# EAGLE design Redhat-Thumbprint (EAGLE 7.7.0)
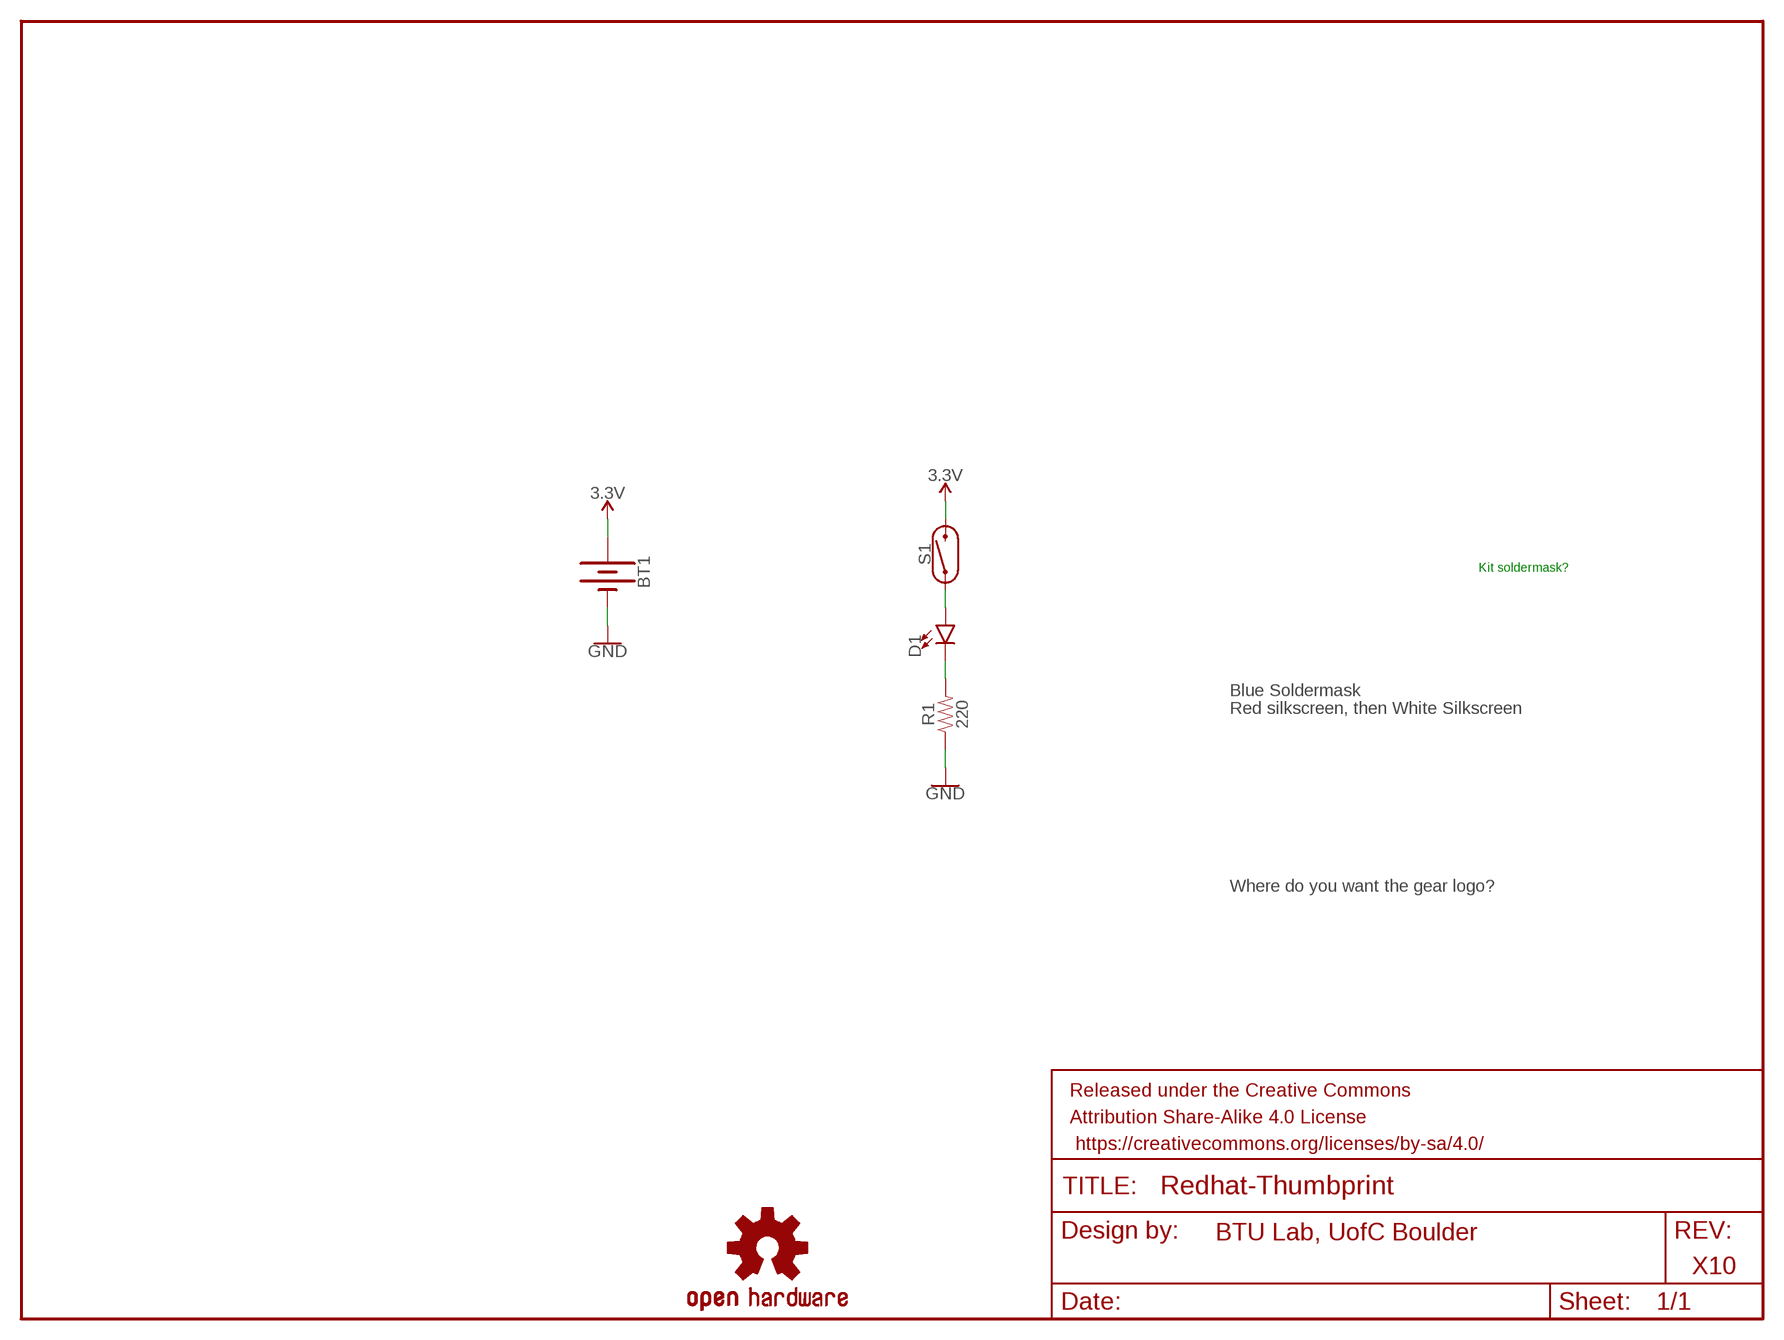
[diagram p0: schematic, sheet 1]

## Parts
BT1  BATTERY-20MM_PTH  [BATTCOM_20MM_PTH]
D1  LEDRED  [LED_5MM_EXTRASILK]
FRAME1  FRAME-LETTER  [CREATIVE_COMMONS]
LOGO4  OSHW-LOGOS  [OSHW-LOGO-S]
R1  220  1KOHM-HORIZ-1/4W-1%  [AXIAL-0.3]
S1  REED_SWITCH-PTH-INSULATED  [REED_SWITCH_PLASTIC]

## Nets
3.3V: BT1.1(+) S1.P$2
GND: BT1.2(-) R1.P$1
N$3: D1.K(C) R1.P$2
N$4: D1.A S1.P$1

## Notes on the sheet
- Kit soldermask?
- Blue Soldermask
- Red silkscreen, then White Silkscreen
- Where do you want the gear logo?
- BTU Lab, UofC Boulder
- X10

## Library data of the parts
BT1 = SparkFun-Batteries:BATTERY: Battery - Single Cell A variety of battery chemistries, sizes, and footprints. Device List: 20MM_PTH - Coin Cell Battery Holder - 20mm (PTH) <https://www.sparkfun.com/products/783> 12MM_SMD - Coin Cell Battery Holder - 12mm (SMD) <https://www.sparkfun.com/products/10592> 12MM_PTH - Coin Cell Battery Holder - 12mm (PTH) <https://www.sparkfun.com/products/7948> 20MM_SMD - 20mm Coin Cell Battery Holder (SMD) (2 legs) Used on the Big Time Watch Kit <https://www.sparkfun.com/products/11734> 20MM_SMD_4LEGS - Coin Cell Battery Holder - 20mm (SMD) <https://www.sparkfun.com/products/11892> 20MM_SMD_4LEGS_OVERPASTE - Coin Cell Battery Holder - 20mm (SMD) <https://www.sparkfun.com/products/11892> (Over-paste on the legs) 24.5MM_PTH - Coin Cell Battery Holder - 24.5mm (PTH) <https://www.sparkfun.com/products/8863> 9V - 9V Battery Holder - PC Mount Used on the SparkFun SparkPunk Sound Kit <https://www.sparkfun.com/products/11177> and SparkFun SparkPunk Sequencer Kit <https://www.sparkfun.com/products/12707> 18650 - Battery Holder - 18650 (PTH) <https://www.sparkfun.com/products/13113> AA - Battery Holder - 1xAA (PTH) <https://www.sparkfun.com/products/7949> AAA - Battery Holder - 1xAAA (PTH) <https://www.sparkfun.com/products/12718> AA_KIT - Battery Holder - 1xAA (PTH) <https://www.sparkfun.com/products/7949> Special kit package - pads only have exposed copper on one side of the board. AAA_KIT - Battery Holder - 1xAAA (PTH) <https://www.sparkfun.com/products/12718> Special kit package - pads only have exposed copper on one side of the board.; PROD_ID: BATT-09031; SF_SKU: PRT-00783
D1 = SparkX:LED
FRAME1 = SparkFun-Aesthetics:FRAME-LETTER: Schematic Frame - Letter Standard 8.5x11 US Letter frame
LOGO4 = SparkFun-Aesthetics:OSHW-LOGO: Open-Source Hardware (OSHW) Logo This logo indicates the piece of hardware it is found on incorporates a OSHW license and/or adheres to the definition of open source hardware found here: http://freedomdefined.org/OSHW
R1 = SparkFun-Resistors:1KOHM: 1kΩ resistor A resistor is a passive two-terminal electrical component that implements electrical resistance as a circuit element. Resistors act to reduce current flow, and, at the same time, act to lower voltage levels within circuits. - Wikipedia; PROD_ID: RES-12182; VALUE: 1k
S1 = SparkFun-Switches:REED_SWITCH: Reed Switch A reed switch is a magnetically-actuated switch. When the device is exposed to a magnetic field, the two ferrous materials inside the switch pull together and the switch closes. Variant Overview PTH-GLASS Reed Switch <https://www.sparkfun.com/products/8642> (COM-08642) - PTH reed switch w/ glass body (6.0 x 0.9 mm) PTH-INSULATED Reed Switch - Insulated <https://www.sparkfun.com/products/10601> (COM-10601) - PTH reed switch w/ insulated body (15.1 x 4.2 mm); PROD_ID: SWCH-10467; SF_SKU: COM-10601

## Board
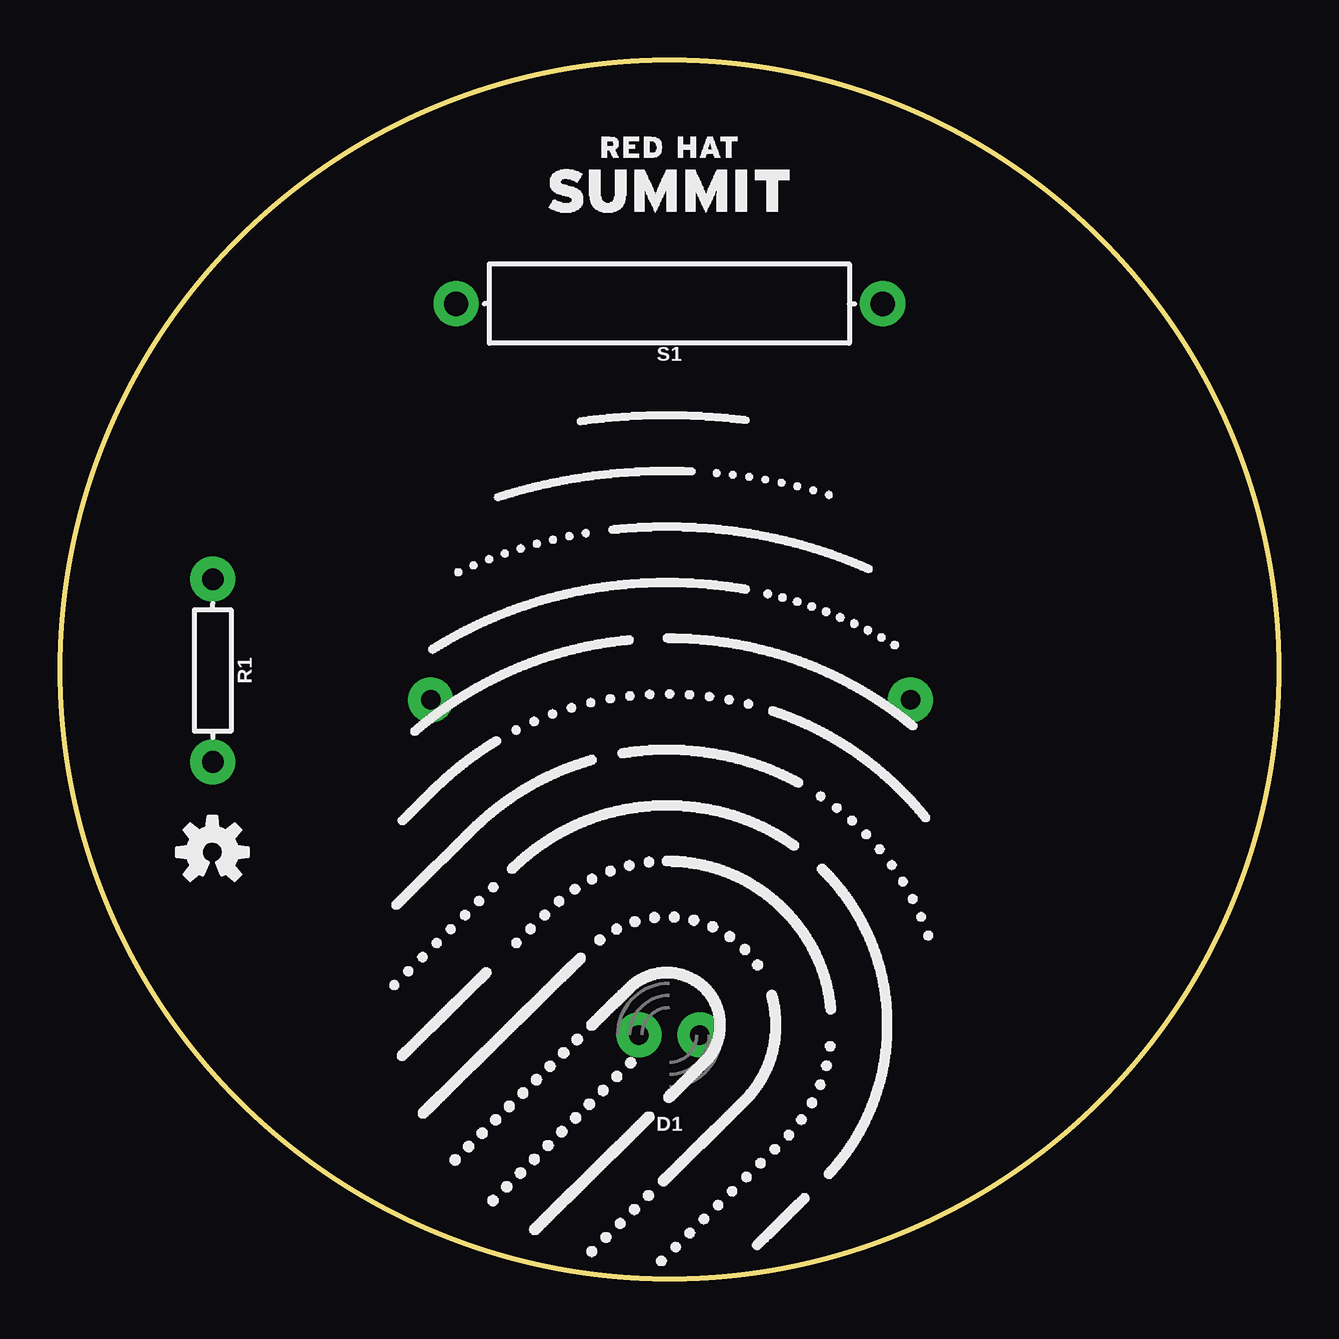
[diagram p1: board, top side]
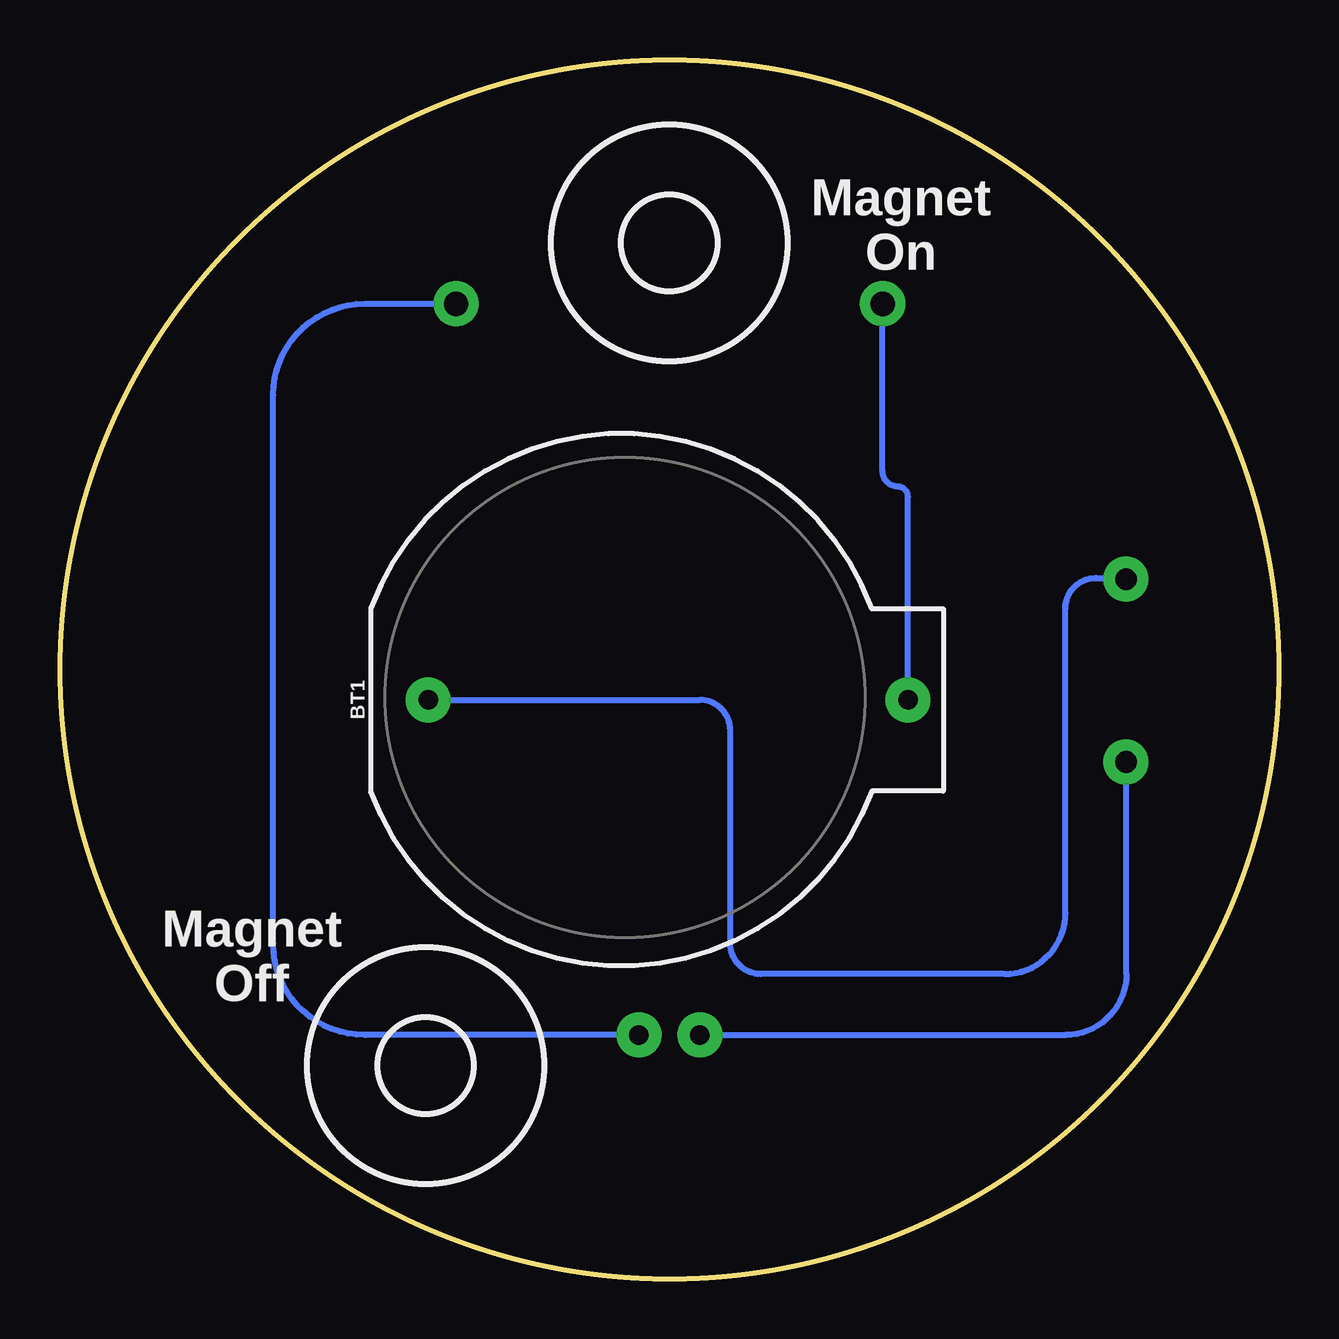
[diagram p2: board, bottom side, seen from below]

Size 50.8 x 50.8 mm. Coordinates in mm from the lower left corner, seen from the top.
Outline: circle at 25.4,25.4 radius 25.4
Copper layers (1*16): Top 0.035mm / dielectric 1.5mm / Bottom 0.035mm
Design rules "SparkFun-2-layer-TIGHT": minimum track width 7mil, minimum drill 15mil, track to track 7mil, track to pad 7mil, pad to pad 7mil, via to via 7mil, smd to smd 7mil, copper to edge 7mil, drill to drill 7mil, minimum pad ring 7mil, minimum via ring 7mil, stop-mask expansion 4mil, vias tented up to drill 25mil, thermal gap 10mil

### Footprints (pad centres in the part's own frame; a part is rotated, then mirrored left to right if it is on the bottom)
BATTCOM_20MM_PTH = drill 0.813 pad 1.88: 1 11.85,0; 2 -8.15,0
LED_5MM_EXTRASILK = drill 0.813 pad 1.88: A -1.27,0; K 1.27,0
AXIAL-0.3 = drill 0.9 pad 1.88: P$1 -3.81,0; P$2 3.81,0
REED_SWITCH_PLASTIC = drill 1.016 pad 1.88: P$1 -8.89,0; P$2 8.89,0

### Placement (x,y rotation side)
BT1  27.3,24.13 0 bottom
D1  25.4,10.16 180 top
FRAME1  -19.05,-25.4 0 top  (outside the outline)
LOGO4  6.35,17.78 0 top
R1  6.37,25.35 270 top
S1  25.4,40.64 180 top

### Tracks (layer width: path | path; a pad name or v marks a point on that pad's centre or on a via)
3.3V
  Bottom 0.254: BT1.1 15.45,32.6 arc-90 15.87,33.02 arc90 16.51,33.66 S1.P$2
GND
  Bottom 0.254: BT1.2 24.13,24.13 arc90 22.86,22.86 22.86,13.97 arc-90 21.59,12.7 11.43,12.7 arc-90 8.89,15.24 8.89,27.94 arc90 7.62,29.21 6.42,29.21 arc90 R1.P$1
N$3
  Bottom 0.254: D1.K 8.89,10.16 arc-90 6.35,12.7 6.35,21.52 R1.P$2
N$4
  Bottom 0.254: D1.A 38.1,10.16 arc90 41.91,13.97 41.91,36.83 arc90 38.1,40.64 S1.P$1

### Text on the board
Dimension: Blue Soldermask / / First top silk: Red [File GTR] / Second top silk: White [File GTO] / / Bottom silk: White [File GBO]
bPlace: Magnet / On | Magnet / Off
tDocu: BTU Lab, UofC Boulder